# Altium project ESP32_LED_Matrix.PrjPcb
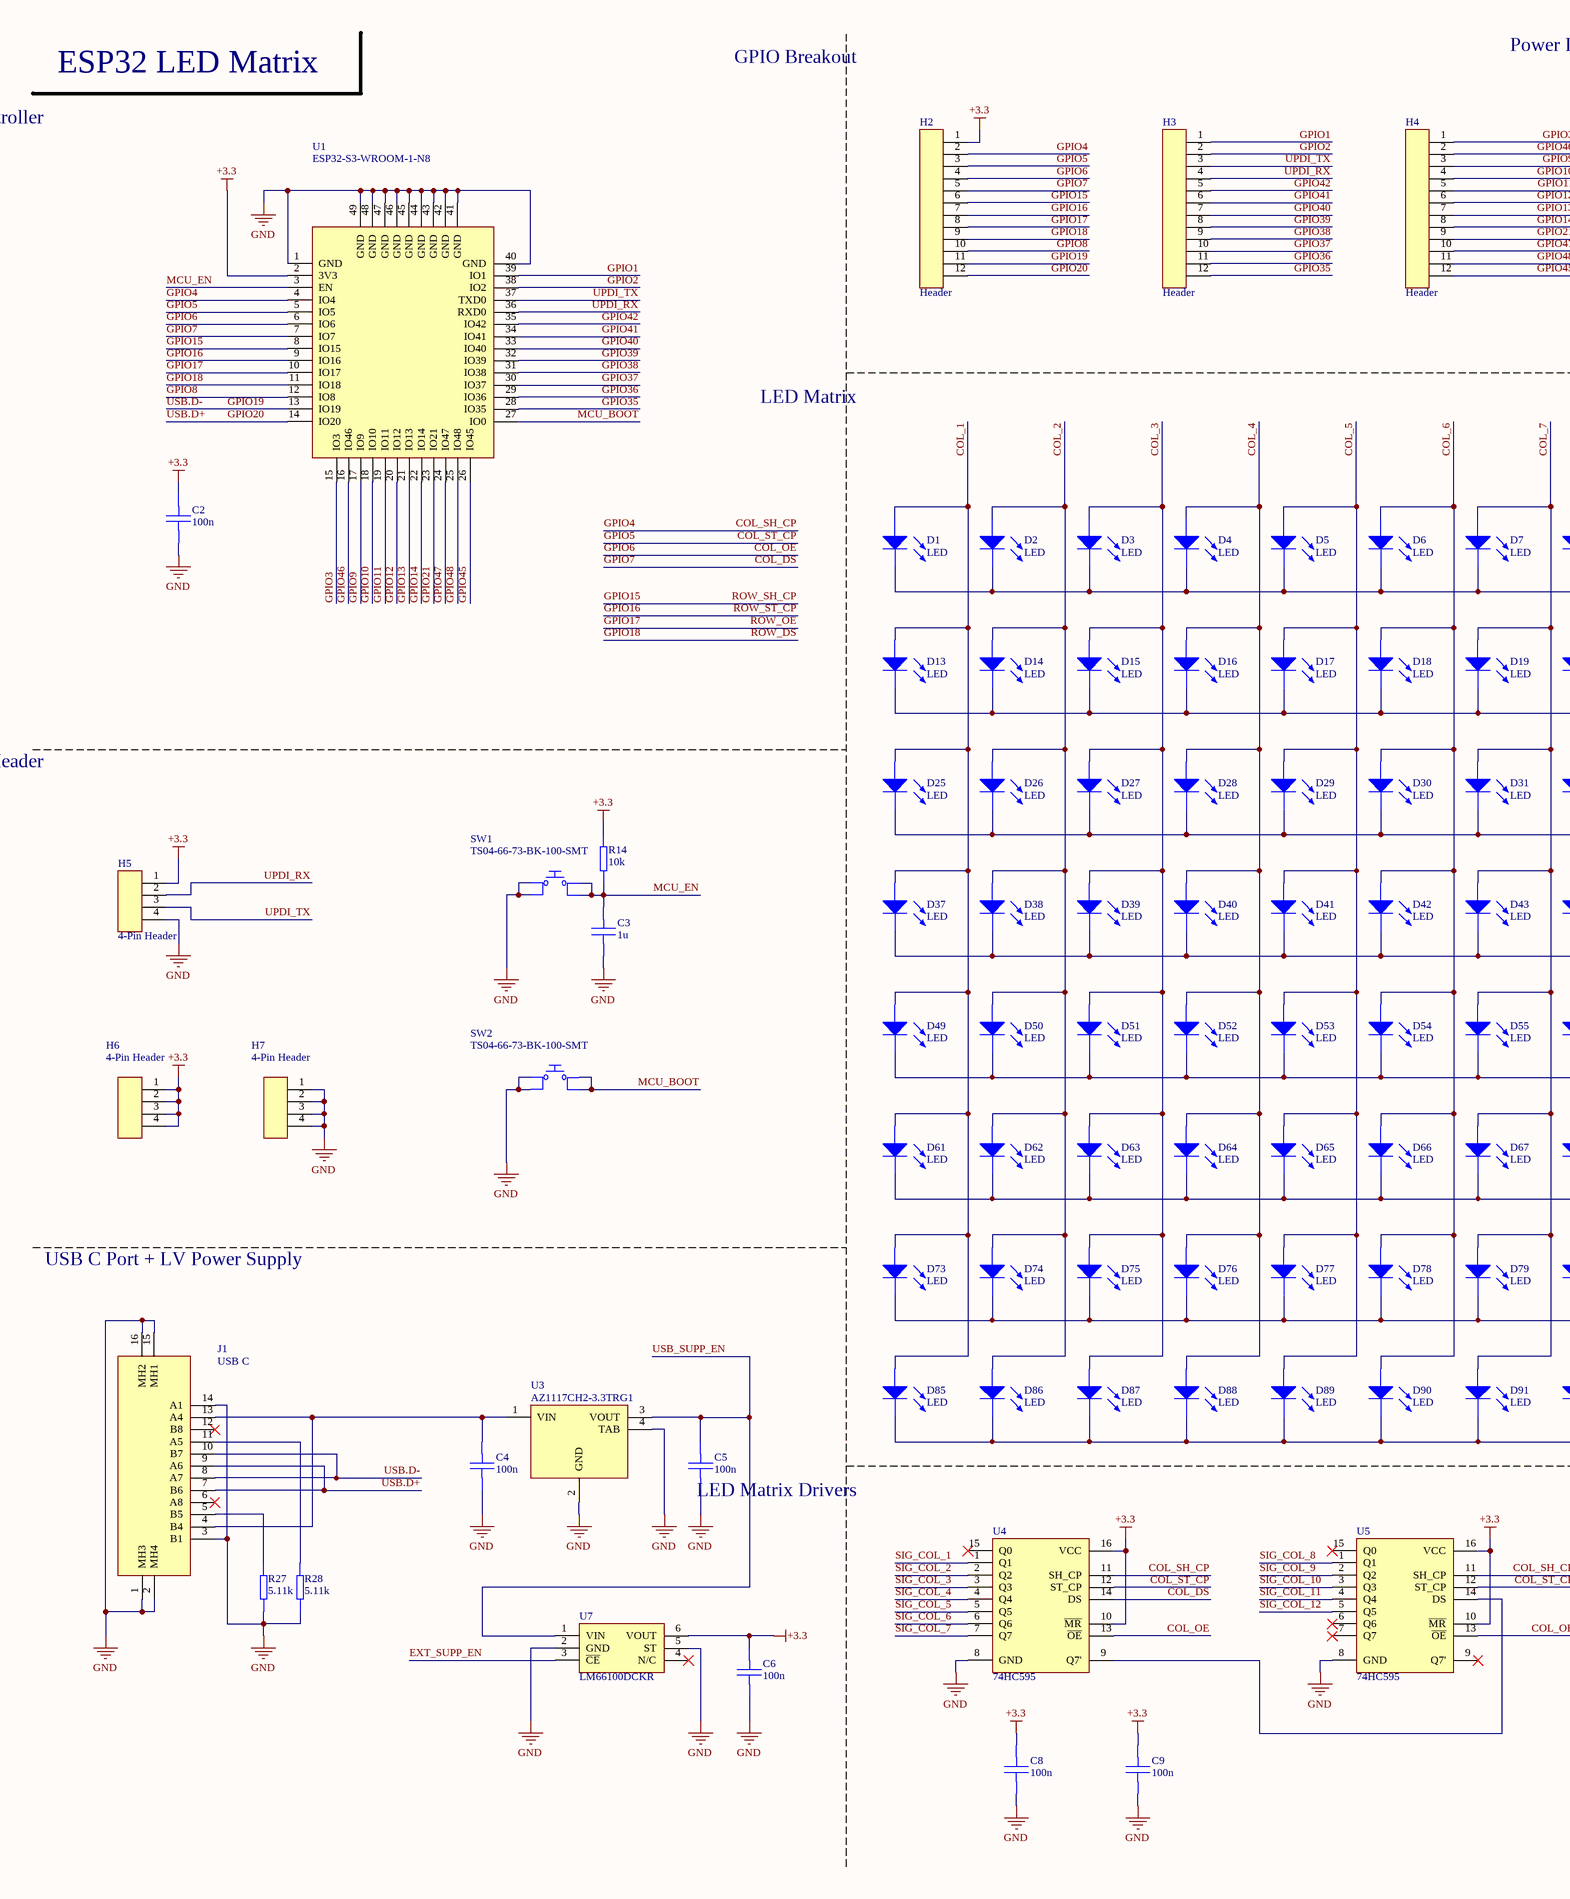
[diagram p0: ESP32_LED_Matrix.SchDoc, left]
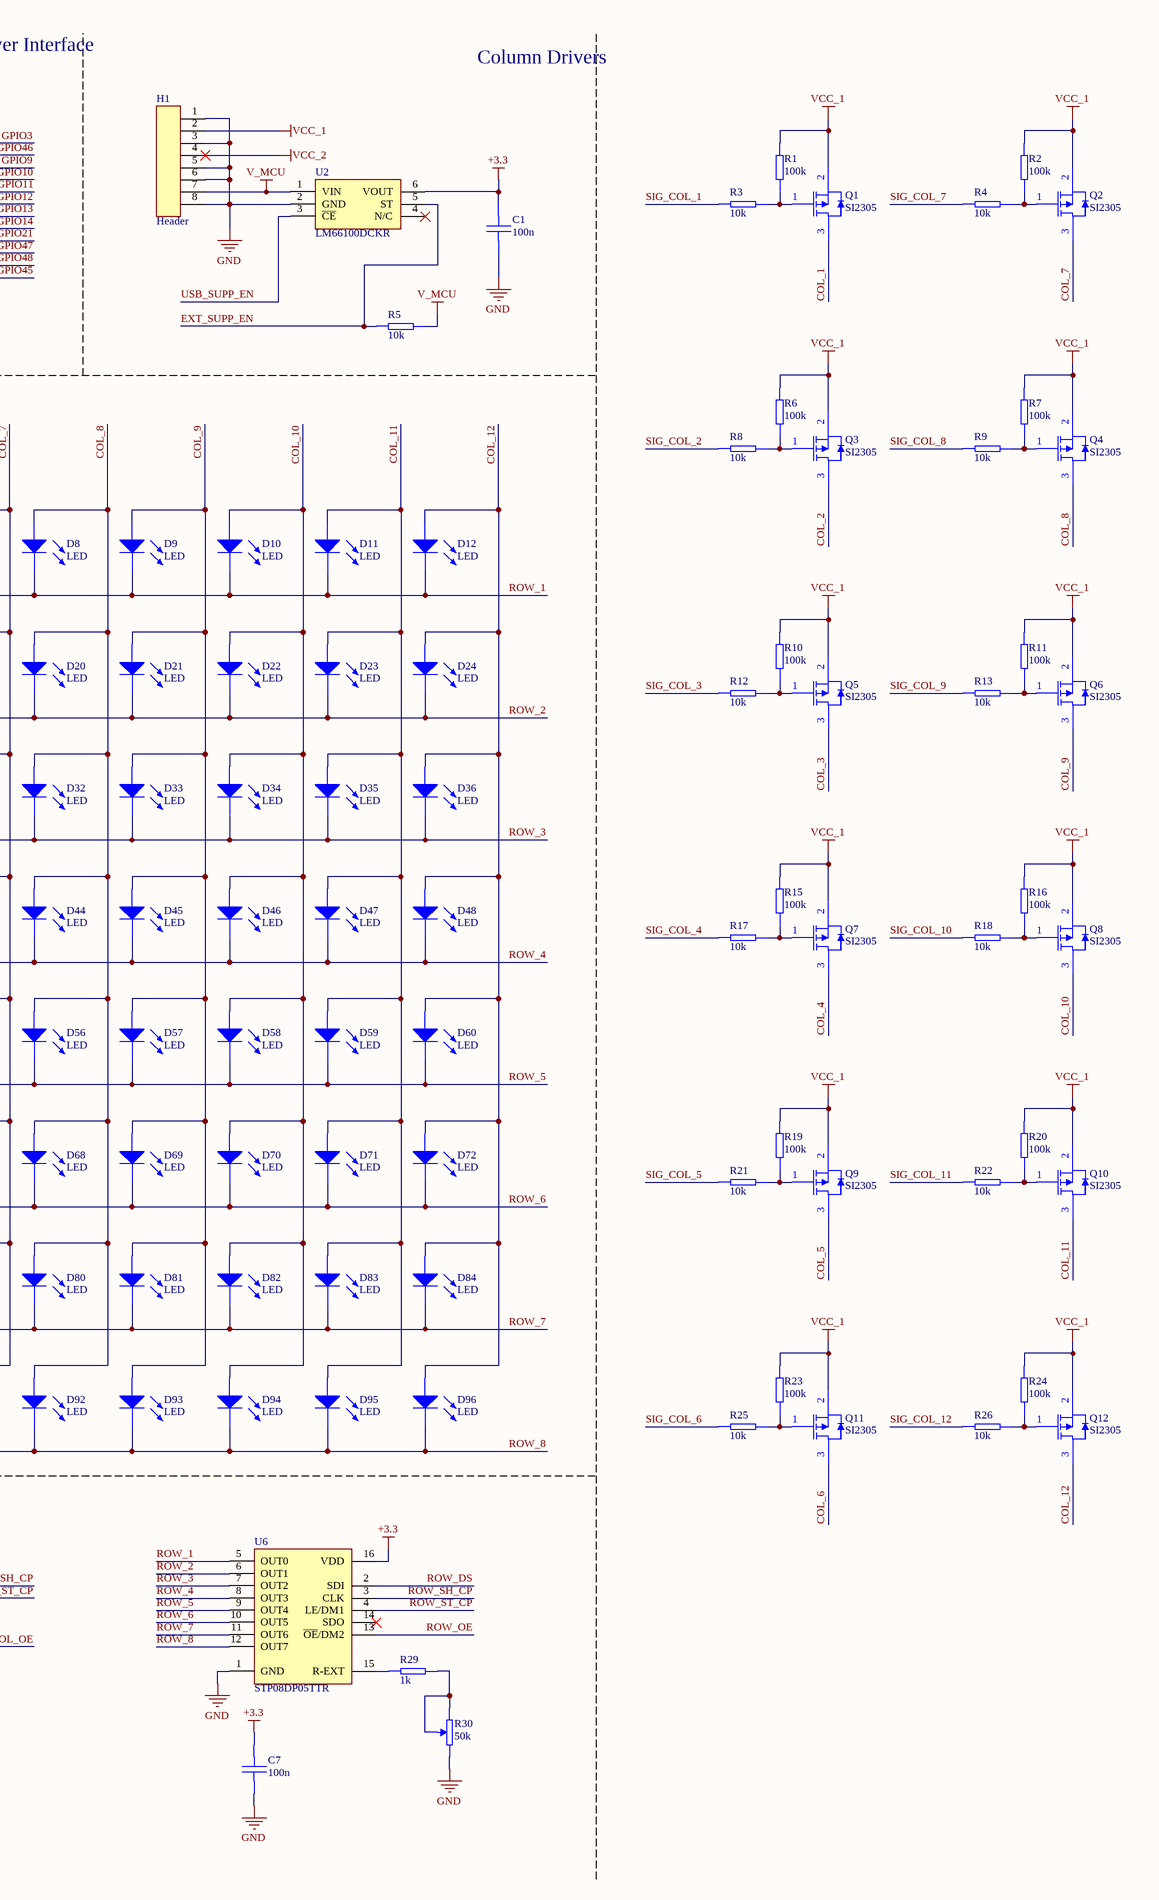
[diagram p1: ESP32_LED_Matrix.SchDoc, right]
1 sheet, 164 parts. Net scope: global (net labels, ports and power ports of the same name join across sheets).
Board file: ESP32_LED_Matrix.PcbDoc

## Sheet ESP32_LED_Matrix.SchDoc
size A2; SheetNumber: 1; SheetTotal: 1

### Parts
C1  100n  [CAP0805]
C2  100n  [CAP0805]
C3  1u  [CAP0805]
C4  100n  [CAP0805]
C5  100n  [CAP0805]
C6  100n  [CAP0805]
C7  100n  [CAP0805]
C8  100n  [CAP0805]
C9  100n  [CAP0805]
D1  LED  [LEDM2012X80N]
D2  LED  [LEDM2012X80N]
D3  LED  [LEDM2012X80N]
D4  LED  [LEDM2012X80N]
D5  LED  [LEDM2012X80N]
D6  LED  [LEDM2012X80N]
D7  LED  [LEDM2012X80N]
D8  LED  [LEDM2012X80N]
D9  LED  [LEDM2012X80N]
D10  LED  [LEDM2012X80N]
D11  LED  [LEDM2012X80N]
D12  LED  [LEDM2012X80N]
D13  LED  [LEDM2012X80N]
D14  LED  [LEDM2012X80N]
D15  LED  [LEDM2012X80N]
D16  LED  [LEDM2012X80N]
D17  LED  [LEDM2012X80N]
D18  LED  [LEDM2012X80N]
D19  LED  [LEDM2012X80N]
D20  LED  [LEDM2012X80N]
D21  LED  [LEDM2012X80N]
D22  LED  [LEDM2012X80N]
D23  LED  [LEDM2012X80N]
D24  LED  [LEDM2012X80N]
D25  LED  [LEDM2012X80N]
D26  LED  [LEDM2012X80N]
D27  LED  [LEDM2012X80N]
D28  LED  [LEDM2012X80N]
D29  LED  [LEDM2012X80N]
D30  LED  [LEDM2012X80N]
D31  LED  [LEDM2012X80N]
D32  LED  [LEDM2012X80N]
D33  LED  [LEDM2012X80N]
D34  LED  [LEDM2012X80N]
D35  LED  [LEDM2012X80N]
D36  LED  [LEDM2012X80N]
D37  LED  [LEDM2012X80N]
D38  LED  [LEDM2012X80N]
D39  LED  [LEDM2012X80N]
D40  LED  [LEDM2012X80N]
D41  LED  [LEDM2012X80N]
D42  LED  [LEDM2012X80N]
D43  LED  [LEDM2012X80N]
D44  LED  [LEDM2012X80N]
D45  LED  [LEDM2012X80N]
D46  LED  [LEDM2012X80N]
D47  LED  [LEDM2012X80N]
D48  LED  [LEDM2012X80N]
D49  LED  [LEDM2012X80N]
D50  LED  [LEDM2012X80N]
D51  LED  [LEDM2012X80N]
D52  LED  [LEDM2012X80N]
D53  LED  [LEDM2012X80N]
D54  LED  [LEDM2012X80N]
D55  LED  [LEDM2012X80N]
D56  LED  [LEDM2012X80N]
D57  LED  [LEDM2012X80N]
D58  LED  [LEDM2012X80N]
D59  LED  [LEDM2012X80N]
D60  LED  [LEDM2012X80N]
D61  LED  [LEDM2012X80N]
D62  LED  [LEDM2012X80N]
D63  LED  [LEDM2012X80N]
D64  LED  [LEDM2012X80N]
D65  LED  [LEDM2012X80N]
D66  LED  [LEDM2012X80N]
D67  LED  [LEDM2012X80N]
D68  LED  [LEDM2012X80N]
D69  LED  [LEDM2012X80N]
D70  LED  [LEDM2012X80N]
D71  LED  [LEDM2012X80N]
D72  LED  [LEDM2012X80N]
D73  LED  [LEDM2012X80N]
D74  LED  [LEDM2012X80N]
D75  LED  [LEDM2012X80N]
D76  LED  [LEDM2012X80N]
D77  LED  [LEDM2012X80N]
D78  LED  [LEDM2012X80N]
D79  LED  [LEDM2012X80N]
D80  LED  [LEDM2012X80N]
D81  LED  [LEDM2012X80N]
D82  LED  [LEDM2012X80N]
D83  LED  [LEDM2012X80N]
D84  LED  [LEDM2012X80N]
D85  LED  [LEDM2012X80N]
D86  LED  [LEDM2012X80N]
D87  LED  [LEDM2012X80N]
D88  LED  [LEDM2012X80N]
D89  LED  [LEDM2012X80N]
D90  LED  [LEDM2012X80N]
D91  LED  [LEDM2012X80N]
D92  LED  [LEDM2012X80N]
D93  LED  [LEDM2012X80N]
D94  LED  [LEDM2012X80N]
D95  LED  [LEDM2012X80N]
D96  LED  [LEDM2012X80N]
H1  Header  [Header_1X8]
H2  Header  [Header_1X12]
H3  Header  [Header_1X12]
H4  Header  [Header_1X12]
H5  4-Pin Header  [Header_1X4]
H6  4-Pin Header  [Header_1X4]
H7  4-Pin Header  [Header_1X4]
J1  USB C  [USB TYPE C 12 PIN]
Q1  SI2305  [SOT23]
Q2  SI2305  [SOT23]
Q3  SI2305  [SOT23]
Q4  SI2305  [SOT23]
Q5  SI2305  [SOT23]
Q6  SI2305  [SOT23]
Q7  SI2305  [SOT23]
Q8  SI2305  [SOT23]
Q9  SI2305  [SOT23]
Q10  SI2305  [SOT23]
Q11  SI2305  [SOT23]
Q12  SI2305  [SOT23]
R1  100k  [RESC0805]
R2  100k  [RESC0805]
R3  10k  [RESC0805]
R4  10k  [RESC0805]
R5  10k  [RESC0805]
R6  100k  [RESC0805]
R7  100k  [RESC0805]
R8  10k  [RESC0805]
R9  10k  [RESC0805]
R10  100k  [RESC0805]
R11  100k  [RESC0805]
R12  10k  [RESC0805]
R13  10k  [RESC0805]
R14  10k  [RESC0805]
R15  100k  [RESC0805]
R16  100k  [RESC0805]
R17  10k  [RESC0805]
R18  10k  [RESC0805]
R19  100k  [RESC0805]
R20  100k  [RESC0805]
R21  10k  [RESC0805]
R22  10k  [RESC0805]
R23  100k  [RESC0805]
R24  100k  [RESC0805]
R25  10k  [RESC0805]
R26  10k  [RESC0805]
R27  5.11k  [RESC0805]
R28  5.11k  [RESC0805]
R29  1k  [RESC0805]
R30  50k  [3339P1103LF]
SW1  TS04-66-73-BK-100-SMT  [Tactile Button 6.0mm x 6.0mm]
SW2  TS04-66-73-BK-100-SMT  [Tactile Button 6.0mm x 6.0mm]
U1  ESP32-S3-WROOM-1-N8  [ESP32-S3-WROOM-1-N8]
U2  LM66100DCKR  [SC70-6]
U3  AZ1117CH2-3.3TRG1  [SOT223]
U4  74HC595  [TSSOP16]
U5  74HC595  [TSSOP16]
U6  STP08DP05TTR  [TSSOP16]
U7  LM66100DCKR  [SC70-6]

### Nets
+3.3: C1.1 C2.1 C6.1 C7.1 C8.1 C9.1 H2.1 H5.1 H6.1 H6.2 H6.3 H6.4 R14.1 U1.2(3V3) U2.6(VOUT) U4.10(~{MR}) U4.16(VCC) U5.10(~{MR}) U5.16(VCC) U6.16(VDD) U7.6(VOUT)
GND: C1.2 C2.2 C3.2 C4.2 C5.2 C6.2 C7.2 C8.2 C9.2 H1.1 H1.3 H1.5 H1.6 H1.8 H5.4 H7.1 H7.2 H7.3 H7.4 J1.1(MH3) J1.2(MH4) J1.3(B1) J1.14(A1) J1.15(MH1) J1.16(MH2) R27.1 R28.1 R30.3 SW1.1 SW1.2 SW2.1 SW2.2 U1.1(GND) U1.40(GND) U1.41(GND) U1.42(GND) U1.43(GND) U1.44(GND) U1.45(GND) U1.46(GND) U1.47(GND) U1.48(GND) U1.49(GND) U2.2(GND) U3.2(GND) U3.4(TAB) U4.8(GND) U5.8(GND) U6.1(GND) U7.2(GND) U7.5(ST)
V_MCU: H1.7 R5.2 U2.1(VIN)
VCC_1: H1.2 Q1.2(S) Q2.2(S) Q3.2(S) Q4.2(S) Q5.2(S) Q6.2(S) Q7.2(S) Q8.2(S) Q9.2(S) Q10.2(S) Q11.2(S) Q12.2(S) R1.1 R2.1 R6.1 R7.1 R10.1 R11.1 R15.1 R16.1 R19.1 R20.1 R23.1 R24.1
VCC_2: H1.4
COL_1: D1.2(A) D13.2(A) D25.2(A) D37.2(A) D49.2(A) D61.2(A) D73.2(A) D85.2(A) Q1.3(D)
COL_2: D2.2(A) D14.2(A) D26.2(A) D38.2(A) D50.2(A) D62.2(A) D74.2(A) D86.2(A) Q3.3(D)
COL_3: D3.2(A) D15.2(A) D27.2(A) D39.2(A) D51.2(A) D63.2(A) D75.2(A) D87.2(A) Q5.3(D)
COL_4: D4.2(A) D16.2(A) D28.2(A) D40.2(A) D52.2(A) D64.2(A) D76.2(A) D88.2(A) Q7.3(D)
COL_5: D5.2(A) D17.2(A) D29.2(A) D41.2(A) D53.2(A) D65.2(A) D77.2(A) D89.2(A) Q9.3(D)
COL_6: D6.2(A) D18.2(A) D30.2(A) D42.2(A) D54.2(A) D66.2(A) D78.2(A) D90.2(A) Q11.3(D)
COL_7: D7.2(A) D19.2(A) D31.2(A) D43.2(A) D55.2(A) D67.2(A) D79.2(A) D91.2(A) Q2.3(D)
COL_8: D8.2(A) D20.2(A) D32.2(A) D44.2(A) D56.2(A) D68.2(A) D80.2(A) D92.2(A) Q4.3(D)
COL_9: D9.2(A) D21.2(A) D33.2(A) D45.2(A) D57.2(A) D69.2(A) D81.2(A) D93.2(A) Q6.3(D)
COL_10: D10.2(A) D22.2(A) D34.2(A) D46.2(A) D58.2(A) D70.2(A) D82.2(A) D94.2(A) Q8.3(D)
COL_11: D11.2(A) D23.2(A) D35.2(A) D47.2(A) D59.2(A) D71.2(A) D83.2(A) D95.2(A) Q10.3(D)
COL_12: D12.2(A) D24.2(A) D36.2(A) D48.2(A) D60.2(A) D72.2(A) D84.2(A) D96.2(A) Q12.3(D)
COL_DS: H2.5 U1.7(IO7) U4.14(DS)  [also labelled GPIO7]
COL_OE: H2.4 U1.6(IO6) U4.13(~{OE}) U5.13(~{OE})  [also labelled GPIO6]
COL_SH_CP: H2.2 U1.4(IO4) U4.11(SH_CP) U5.11(SH_CP)  [also labelled GPIO4]
COL_ST_CP: H2.3 U1.5(IO5) U4.12(ST_CP) U5.12(ST_CP)  [also labelled GPIO5]
EXT_SUPP_EN: R5.1 U2.5(ST) U7.3(~{CE})
GPIO1: H3.1 U1.39(IO1)
GPIO2: H3.2 U1.38(IO2)
GPIO3: H4.1 U1.15(IO3)
GPIO8: H2.10 U1.12(IO8)
GPIO9: H4.3 U1.17(IO9)
GPIO10: H4.4 U1.18(IO10)
GPIO11: H4.5 U1.19(IO11)
GPIO12: H4.6 U1.20(IO12)
GPIO13: H4.7 U1.21(IO13)
GPIO14: H4.8 U1.22(IO14)
GPIO15: H2.6 U1.8(IO15) U6.3(CLK)  [also labelled ROW_SH_CP]
GPIO16: H2.7 U1.9(IO16) U6.4(LE/DM1)  [also labelled ROW_ST_CP]
GPIO17: H2.8 U1.10(IO17) U6.13(~{OE}/DM2)  [also labelled ROW_OE]
GPIO18: H2.9 U1.11(IO18) U6.2(SDI)  [also labelled ROW_DS]
GPIO19: H2.11 J1.8(A7) J1.10(B7) U1.13(IO19)  [also labelled USB.D-]
GPIO20: H2.12 J1.7(B6) J1.9(A6) U1.14(IO20)  [also labelled USB.D+]
GPIO21: H4.9 U1.23(IO21)
GPIO35: H3.12 U1.28(IO35)
GPIO36: H3.11 U1.29(IO36)
GPIO37: H3.10 U1.30(IO37)
GPIO38: H3.9 U1.31(IO38)
GPIO39: H3.8 U1.32(IO39)
GPIO40: H3.7 U1.33(IO40)
GPIO41: H3.6 U1.34(IO41)
GPIO42: H3.5 U1.35(IO42)
GPIO45: H4.12 U1.26(IO45)
GPIO46: H4.2 U1.16(IO46)
GPIO47: H4.10 U1.24(IO47)
GPIO48: H4.11 U1.25(IO48)
MCU_BOOT: SW2.3 SW2.4 U1.27(IO0)
MCU_EN: C3.1 R14.2 SW1.3 SW1.4 U1.3(EN)
ROW_1: D1.1(K) D2.1(K) D3.1(K) D4.1(K) D5.1(K) D6.1(K) D7.1(K) D8.1(K) D9.1(K) D10.1(K) D11.1(K) D12.1(K) U6.5(OUT0)
ROW_2: D13.1(K) D14.1(K) D15.1(K) D16.1(K) D17.1(K) D18.1(K) D19.1(K) D20.1(K) D21.1(K) D22.1(K) D23.1(K) D24.1(K) U6.6(OUT1)
ROW_3: D25.1(K) D26.1(K) D27.1(K) D28.1(K) D29.1(K) D30.1(K) D31.1(K) D32.1(K) D33.1(K) D34.1(K) D35.1(K) D36.1(K) U6.7(OUT2)
ROW_4: D37.1(K) D38.1(K) D39.1(K) D40.1(K) D41.1(K) D42.1(K) D43.1(K) D44.1(K) D45.1(K) D46.1(K) D47.1(K) D48.1(K) U6.8(OUT3)
ROW_5: D49.1(K) D50.1(K) D51.1(K) D52.1(K) D53.1(K) D54.1(K) D55.1(K) D56.1(K) D57.1(K) D58.1(K) D59.1(K) D60.1(K) U6.9(OUT4)
ROW_6: D61.1(K) D62.1(K) D63.1(K) D64.1(K) D65.1(K) D66.1(K) D67.1(K) D68.1(K) D69.1(K) D70.1(K) D71.1(K) D72.1(K) U6.10(OUT5)
ROW_7: D73.1(K) D74.1(K) D75.1(K) D76.1(K) D77.1(K) D78.1(K) D79.1(K) D80.1(K) D81.1(K) D82.1(K) D83.1(K) D84.1(K) U6.11(OUT6)
ROW_8: D85.1(K) D86.1(K) D87.1(K) D88.1(K) D89.1(K) D90.1(K) D91.1(K) D92.1(K) D93.1(K) D94.1(K) D95.1(K) D96.1(K) U6.12(OUT7)
SIG_COL_1: R3.1 U4.1(Q1)
SIG_COL_2: R8.1 U4.2(Q2)
SIG_COL_3: R12.1 U4.3(Q3)
SIG_COL_4: R17.1 U4.4(Q4)
SIG_COL_5: R21.1 U4.5(Q5)
SIG_COL_6: R25.1 U4.6(Q6)
SIG_COL_7: R4.1 U4.7(Q7)
SIG_COL_8: R9.1 U5.1(Q1)
SIG_COL_9: R13.1 U5.2(Q2)
SIG_COL_10: R18.1 U5.3(Q3)
SIG_COL_11: R22.1 U5.4(Q4)
SIG_COL_12: R26.1 U5.5(Q5)
UPDI_RX: H3.4 H5.2 U1.36(RXD0)
UPDI_TX: H3.3 H5.3 U1.37(TXD0)
USB_SUPP_EN: C5.1 U2.3(~{CE}) U3.3(VOUT) U7.1(VIN)
NetC4_1: C4.1 J1.4(B4) J1.13(A4) U3.1(VIN)
NetJ1_5: J1.5(B5) R27.2
NetJ1_11: J1.11(A5) R28.2
NetQ1_1: Q1.1(G) R1.2 R3.2
NetQ2_1: Q2.1(G) R2.2 R4.2
NetQ3_1: Q3.1(G) R6.2 R8.2
NetQ4_1: Q4.1(G) R7.2 R9.2
NetQ5_1: Q5.1(G) R10.2 R12.2
NetQ6_1: Q6.1(G) R11.2 R13.2
NetQ7_1: Q7.1(G) R15.2 R17.2
NetQ8_1: Q8.1(G) R16.2 R18.2
NetQ9_1: Q9.1(G) R19.2 R21.2
NetQ10_1: Q10.1(G) R20.2 R22.2
NetQ11_1: Q11.1(G) R23.2 R25.2
NetQ12_1: Q12.1(G) R24.2 R26.2
NetR29_1: R29.1 U6.15(R-EXT)
NetR29_2: R29.2 R30.1 R30.2
NetU4_9: U4.9(Q7') U5.14(DS)

Not connected (* = marked no-connect by the designer): J1 6(A8)* 12(B8)*; U2 4(N/C)*; U4 15(Q0)*; U5 6(Q6)* 7(Q7)* 9(Q7')* 15(Q0)*; U6 14(SDO)*; U7 4(N/C)*

### Notes on the sheet
- ESP32 LED Matrix
- GPIO Breakout
- Power Interface
- Column Drivers
- Microcontroller
- LED Matrix
- UPDI Programming Header
- USB C Port + LV Power Supply
- LED Matrix Drivers

### Library data of the parts
C1-C9 = Capacitor - Non Polarized: Non Polarized Capacitor
D1-D96 = LED: General Purpose LED; ComponentLink1Description: Datasheet; ComponentLink1URL: https://www.smc-diodes.com/propdf/1N4148W%20N0571%20REV.E.pdf
H1 = 8-Pin Header: System: Connector
H2-H4 = 12-Pin Header
J1 = USB Type C Connector 12 Pin
Q1-Q12 = SI2305: General Purpose P-Channel MOSFET; ComponentLink1Description: Datasheet; ComponentLink1URL: https://www.vishay.com/docs/64847/si2305cd.pdf
R1-R29 = Resistor
R30 = Potentiometer: Potentionmeter
SW1 SW2 = TS04-66-73-BK-100-SMT: Switch; Manufacturer_Name: Same Sky; Datasheet Link: https://www.sameskydevices.com/product/resource/supplyframepdf/ts04.pdf; Height: 7.6mm; Manufacturer_Part_Number: TS04-66-73-BK-100-SMT; Mouser Part Number: 179-TS046673BK100SMT; Mouser Price/Stock: https://www.mouser.co.uk/ProductDetail/Same-Sky/TS04-66-73-BK-100-SMT?qs=A6eO%252BMLsxmRAmp3wqRUzZw%3D%3D; Arrow Part Number: TS04-66-73-BK-100-SMT; Arrow Price/Stock: https://www.arrow.com/en/products/ts04-66-73-bk-100-smt/cui-devices?utm_currency=USD&region=nac
U1 = ESP32-S3-WROOM-1-N8: ESP32 Microcontroller with Bluetooth and Wifi
U2 U7 = LM66100DCKR: 5.5-V, 1.5-A 79-mΩ, Low IQ Ideal Diode With Input Polarity Protection; Manufacturer_Name: Texas Instruments; Datasheet Link: http://www.ti.com/lit/gpn/LM66100; Height: 1.1mm; Manufacturer_Part_Number: LM66100DCKR; Mouser Part Number: 595-LM66100DCKR; Mouser Price/Stock: https://www.mouser.co.uk/ProductDetail/Texas-Instruments/LM66100DCKR?qs=vLWxofP3U2y2yPPrXoBBoA%3D%3D; Arrow Part Number: LM66100DCKR; Arrow Price/Stock: https://www.arrow.com/en/products/lm66100dckr/texas-instruments?region=nac
U3 = AZ1117CH2-3.3TRG1_1: 3.3V Linear Voltage Regulator
U4 U5 = 74HC595: Shift Register
U6 = STP08DP05TTR: LED Driver; Manufacturer_Name: STMicroelectronics; Datasheet Link: https://componentsearchengine.com/Datasheets/2/STP08DP05TTR.pdf; Height: 1.2mm; Manufacturer_Part_Number: STP08DP05TTR; Mouser Part Number: 511-STP08DP05TTR; Mouser Price/Stock: https://www.mouser.co.uk/ProductDetail/STMicroelectronics/STP08DP05TTR?qs=xgiOkRdDJ0m7T%2FaY25F5vQ%3D%3D; Arrow Part Number: STP08DP05TTR; Arrow Price/Stock: https://www.arrow.com/en/products/stp08dp05ttr/stmicroelectronics?region=nac